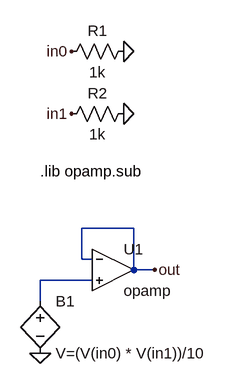
[diagram p0: schematic multiplier.asc]
multiplier.asc, the LTspice schematic file:
Version 4
SHEET 1 1792 680
WIRE 416 -48 336 -48
WIRE 336 0 336 -48
WIRE 352 0 336 0
WIRE 416 16 416 -48
WIRE 448 16 416 16
WIRE 352 32 272 32
WIRE 272 64 272 32
FLAG 320 -320 in0
FLAG 400 -320 0
FLAG 320 -224 in1
FLAG 400 -224 0
FLAG 272 144 0
FLAG 448 16 out
SYMBOL res 416 -336 R90
WINDOW 0 0 56 VBottom 2
WINDOW 3 32 56 VTop 2
SYMATTR InstName R1
SYMATTR Value 1k
SYMBOL res 416 -240 R90
WINDOW 0 0 56 VBottom 2
WINDOW 3 32 56 VTop 2
SYMATTR InstName R2
SYMATTR Value 1k
SYMBOL bv 272 48 R0
SYMATTR InstName B1
SYMATTR Value V=(V(in0) * V(in1))/10
SYMBOL OpAmps/opamp 384 -48 R0
SYMATTR InstName U1
TEXT 272 -136 Left 2 !.lib opamp.sub

The netlist it stands for:
* multiplier.asc
R1 0 in0 1k
R2 0 in1 1k
B1 N001 0 V=(V(in0) * V(in1))/10
XU1 out N001 out opamp Aol=100K GBW=10Meg  ; pins invin noninvin out
.lib opamp.sub
.backanno
.end